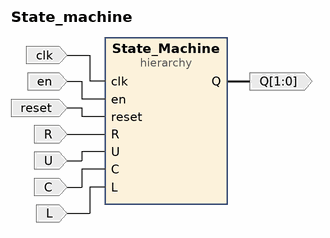
[diagram p0: block diagram of the top level]
# Vivado block design State_machine, xc7a35tcpg236-1, Vivado 2018.3
create_bd_design State_machine

create_bd_port -dir I R
create_bd_port -dir I U
create_bd_port -dir I C
create_bd_port -dir I L
create_bd_port -dir O -from 1 -to 0 Q
create_bd_port -dir I -type clk clk
create_bd_port -dir I en
create_bd_port -dir I -type rst reset

create_bd_cell -type hier State_Machine

# ---- hierarchy /State_Machine ----
current_bd_instance /State_Machine
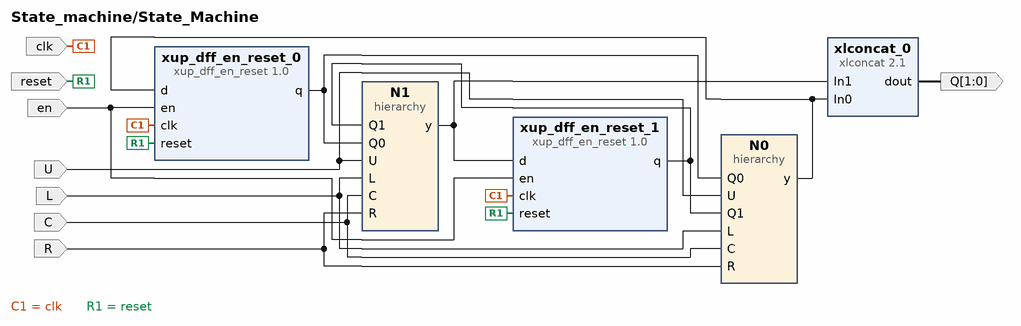
[diagram p1: block diagram inside /State_Machine]
create_bd_pin -dir I -type clk clk
create_bd_pin -dir I en
create_bd_pin -dir I -type rst reset
create_bd_pin -dir O -from 1 -to 0 Q
create_bd_pin -dir I U
create_bd_pin -dir I L
create_bd_pin -dir I C
create_bd_pin -dir I R

create_bd_cell -type ip -vlnv xilinx.com:XUP:xup_dff_en_reset:1.0 xup_dff_en_reset_0
set_property -dict {CONFIG.DELAY 0} [get_bd_cells xup_dff_en_reset_0]
create_bd_cell -type ip -vlnv xilinx.com:ip:xlconcat:2.1 xlconcat_0
create_bd_cell -type ip -vlnv xilinx.com:XUP:xup_dff_en_reset:1.0 xup_dff_en_reset_1
set_property -dict {CONFIG.DELAY 0} [get_bd_cells xup_dff_en_reset_1]
create_bd_cell -type hier N0
create_bd_cell -type hier N1

# ---- hierarchy /State_Machine/N0 ----
current_bd_instance /State_Machine/N0
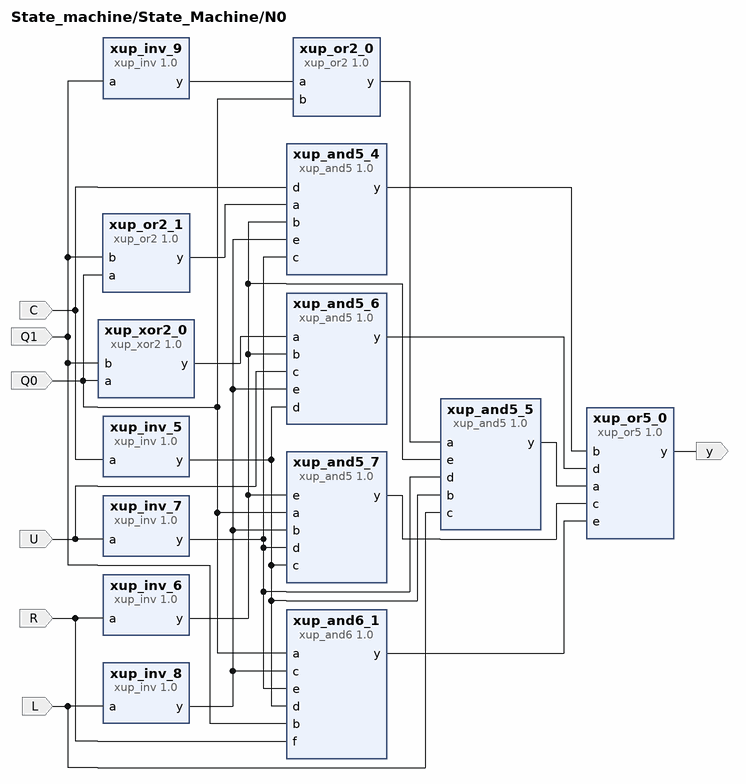
[diagram p2: block diagram inside /State_Machine/N0]
create_bd_pin -dir I Q0
create_bd_pin -dir I Q1
create_bd_pin -dir I U
create_bd_pin -dir I L
create_bd_pin -dir O y
create_bd_pin -dir I C
create_bd_pin -dir I R

create_bd_cell -type ip -vlnv xilinx.com:XUP:xup_or2:1.0 xup_or2_1
set_property -dict {CONFIG.DELAY 0} [get_bd_cells xup_or2_1]
create_bd_cell -type ip -vlnv xilinx.com:XUP:xup_inv:1.0 xup_inv_7
set_property -dict {CONFIG.DELAY 0} [get_bd_cells xup_inv_7]
create_bd_cell -type ip -vlnv xilinx.com:XUP:xup_inv:1.0 xup_inv_8
set_property -dict {CONFIG.DELAY 0} [get_bd_cells xup_inv_8]
create_bd_cell -type ip -vlnv xilinx.com:XUP:xup_or5:1.0 xup_or5_0
set_property -dict {CONFIG.DELAY 0} [get_bd_cells xup_or5_0]
create_bd_cell -type ip -vlnv xilinx.com:XUP:xup_xor2:1.0 xup_xor2_0
set_property -dict {CONFIG.DELAY 0} [get_bd_cells xup_xor2_0]
create_bd_cell -type ip -vlnv xilinx.com:XUP:xup_and5:1.0 xup_and5_4
set_property -dict {CONFIG.DELAY 0} [get_bd_cells xup_and5_4]
create_bd_cell -type ip -vlnv xilinx.com:XUP:xup_and5:1.0 xup_and5_5
set_property -dict {CONFIG.DELAY 0} [get_bd_cells xup_and5_5]
create_bd_cell -type ip -vlnv xilinx.com:XUP:xup_and6:1.0 xup_and6_1
set_property -dict {CONFIG.DELAY 0} [get_bd_cells xup_and6_1]
create_bd_cell -type ip -vlnv xilinx.com:XUP:xup_and5:1.0 xup_and5_6
set_property -dict {CONFIG.DELAY 0} [get_bd_cells xup_and5_6]
create_bd_cell -type ip -vlnv xilinx.com:XUP:xup_and5:1.0 xup_and5_7
set_property -dict {CONFIG.DELAY 0} [get_bd_cells xup_and5_7]
create_bd_cell -type ip -vlnv xilinx.com:XUP:xup_inv:1.0 xup_inv_5
set_property -dict {CONFIG.DELAY 0} [get_bd_cells xup_inv_5]
create_bd_cell -type ip -vlnv xilinx.com:XUP:xup_inv:1.0 xup_inv_6
set_property -dict {CONFIG.DELAY 0} [get_bd_cells xup_inv_6]
create_bd_cell -type ip -vlnv xilinx.com:XUP:xup_or2:1.0 xup_or2_0
set_property -dict {CONFIG.DELAY 0} [get_bd_cells xup_or2_0]
create_bd_cell -type ip -vlnv xilinx.com:XUP:xup_inv:1.0 xup_inv_9
set_property -dict {CONFIG.DELAY 0} [get_bd_cells xup_inv_9]

# ---- hierarchy /State_Machine/N1 ----
current_bd_instance /State_Machine/N1
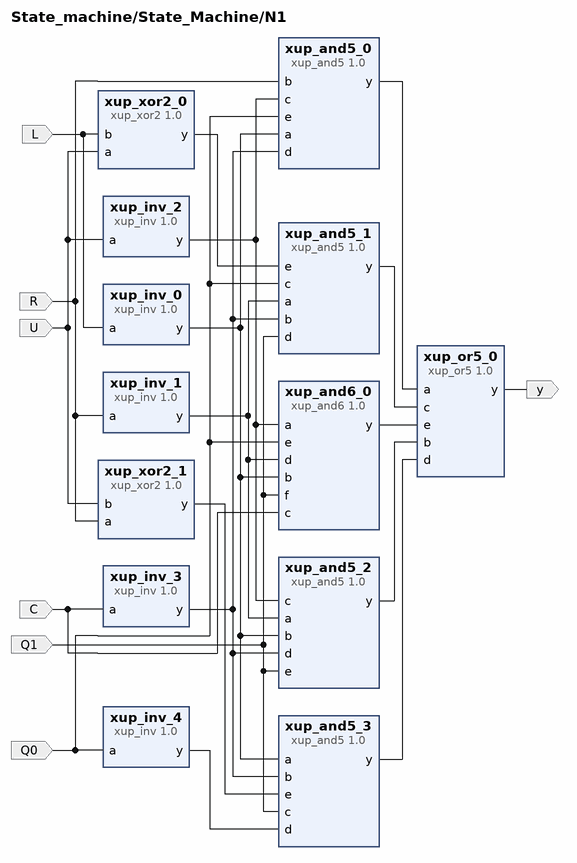
[diagram p3: block diagram inside /State_Machine/N1]
create_bd_pin -dir I Q1
create_bd_pin -dir O y
create_bd_pin -dir I U
create_bd_pin -dir I L
create_bd_pin -dir I C
create_bd_pin -dir I Q0
create_bd_pin -dir I R

create_bd_cell -type ip -vlnv xilinx.com:XUP:xup_and5:1.0 xup_and5_2
set_property -dict {CONFIG.DELAY 0} [get_bd_cells xup_and5_2]
create_bd_cell -type ip -vlnv xilinx.com:XUP:xup_and5:1.0 xup_and5_3
set_property -dict {CONFIG.DELAY 0} [get_bd_cells xup_and5_3]
create_bd_cell -type ip -vlnv xilinx.com:XUP:xup_or5:1.0 xup_or5_0
set_property -dict {CONFIG.DELAY 0} [get_bd_cells xup_or5_0]
create_bd_cell -type ip -vlnv xilinx.com:XUP:xup_xor2:1.0 xup_xor2_0
set_property -dict {CONFIG.DELAY 0} [get_bd_cells xup_xor2_0]
create_bd_cell -type ip -vlnv xilinx.com:XUP:xup_and6:1.0 xup_and6_0
set_property -dict {CONFIG.DELAY 0} [get_bd_cells xup_and6_0]
create_bd_cell -type ip -vlnv xilinx.com:XUP:xup_inv:1.0 xup_inv_0
set_property -dict {CONFIG.DELAY 0} [get_bd_cells xup_inv_0]
create_bd_cell -type ip -vlnv xilinx.com:XUP:xup_inv:1.0 xup_inv_1
set_property -dict {CONFIG.DELAY 0} [get_bd_cells xup_inv_1]
create_bd_cell -type ip -vlnv xilinx.com:XUP:xup_inv:1.0 xup_inv_2
set_property -dict {CONFIG.DELAY 0} [get_bd_cells xup_inv_2]
create_bd_cell -type ip -vlnv xilinx.com:XUP:xup_inv:1.0 xup_inv_3
set_property -dict {CONFIG.DELAY 0} [get_bd_cells xup_inv_3]
create_bd_cell -type ip -vlnv xilinx.com:XUP:xup_inv:1.0 xup_inv_4
set_property -dict {CONFIG.DELAY 0} [get_bd_cells xup_inv_4]
create_bd_cell -type ip -vlnv xilinx.com:XUP:xup_and5:1.0 xup_and5_0
set_property -dict {CONFIG.DELAY 0} [get_bd_cells xup_and5_0]
create_bd_cell -type ip -vlnv xilinx.com:XUP:xup_and5:1.0 xup_and5_1
set_property -dict {CONFIG.DELAY 0} [get_bd_cells xup_and5_1]
create_bd_cell -type ip -vlnv xilinx.com:XUP:xup_xor2:1.0 xup_xor2_1
set_property -dict {CONFIG.DELAY 0} [get_bd_cells xup_xor2_1]

# ---- connections ----

current_bd_instance /State_Machine
connect_bd_net -net xup_or5_0_y1 [get_bd_pins N0/y] [get_bd_pins xup_dff_en_reset_0/d] [get_bd_pins xlconcat_0/In0]
connect_bd_net [get_bd_pins xup_dff_en_reset_0/q] [get_bd_pins N1/Q0] [get_bd_pins N0/Q0]
connect_bd_net -net xup_or5_0_y [get_bd_pins N1/y] [get_bd_pins xup_dff_en_reset_1/d] [get_bd_pins xlconcat_0/In1]
connect_bd_net [get_bd_pins xup_dff_en_reset_1/q] [get_bd_pins N1/Q1] [get_bd_pins N0/Q1]
connect_bd_net -net clk_0_1 [get_bd_pins clk] [get_bd_pins xup_dff_en_reset_1/clk] [get_bd_pins xup_dff_en_reset_0/clk]
connect_bd_net -net en_0_1 [get_bd_pins en] [get_bd_pins xup_dff_en_reset_1/en] [get_bd_pins xup_dff_en_reset_0/en]
connect_bd_net -net reset_0_1 [get_bd_pins reset] [get_bd_pins xup_dff_en_reset_1/reset] [get_bd_pins xup_dff_en_reset_0/reset]
connect_bd_net [get_bd_pins xlconcat_0/dout] [get_bd_pins Q]
connect_bd_net [get_bd_pins U] [get_bd_pins N1/U] [get_bd_pins N0/U]
connect_bd_net [get_bd_pins L] [get_bd_pins N1/L] [get_bd_pins N0/L]
connect_bd_net [get_bd_pins C] [get_bd_pins N1/C] [get_bd_pins N0/C]
connect_bd_net [get_bd_pins R] [get_bd_pins N1/R] [get_bd_pins N0/R]

current_bd_instance /State_Machine/N0
connect_bd_net [get_bd_pins xup_or2_1/y] [get_bd_pins xup_and5_4/a]
connect_bd_net [get_bd_pins xup_inv_7/y] [get_bd_pins xup_and5_5/d] [get_bd_pins xup_and5_4/c] [get_bd_pins xup_and5_7/d] [get_bd_pins xup_and6_1/e]
connect_bd_net [get_bd_pins xup_inv_8/y] [get_bd_pins xup_and5_4/e] [get_bd_pins xup_and5_7/b] [get_bd_pins xup_and6_1/c] [get_bd_pins xup_and5_6/e]
connect_bd_net [get_bd_pins xup_and5_5/y] [get_bd_pins xup_or5_0/a]
connect_bd_net [get_bd_pins xup_and5_4/y] [get_bd_pins xup_or5_0/b]
connect_bd_net [get_bd_pins xup_and5_7/y] [get_bd_pins xup_or5_0/c]
connect_bd_net [get_bd_pins xup_and5_6/y] [get_bd_pins xup_or5_0/d]
connect_bd_net [get_bd_pins xup_and6_1/y] [get_bd_pins xup_or5_0/e]
connect_bd_net [get_bd_pins xup_xor2_0/y] [get_bd_pins xup_and5_6/a]
connect_bd_net [get_bd_pins xup_inv_6/y] [get_bd_pins xup_and5_5/e] [get_bd_pins xup_and5_4/b] [get_bd_pins xup_and5_7/e] [get_bd_pins xup_and5_6/b]
connect_bd_net [get_bd_pins xup_or2_0/y] [get_bd_pins xup_and5_5/a]
connect_bd_net [get_bd_pins xup_inv_5/y] [get_bd_pins xup_and5_5/b] [get_bd_pins xup_and5_7/c] [get_bd_pins xup_and6_1/d] [get_bd_pins xup_and5_6/d]
connect_bd_net [get_bd_pins xup_inv_9/y] [get_bd_pins xup_or2_0/a]
connect_bd_net -net xup_dff_en_reset_0_q [get_bd_pins Q0] \
  [get_bd_pins xup_xor2_0/a] [get_bd_pins xup_or2_0/b] [get_bd_pins xup_and5_7/a] [get_bd_pins xup_and6_1/a] \
  [get_bd_pins xup_or2_1/a]
connect_bd_net -net xup_dff_en_reset_1_q [get_bd_pins Q1] \
  [get_bd_pins xup_inv_9/a] [get_bd_pins xup_xor2_0/b] [get_bd_pins xup_and6_1/b] [get_bd_pins xup_or2_1/b]
connect_bd_net [get_bd_pins U] [get_bd_pins xup_and5_6/c] [get_bd_pins xup_inv_7/a]
connect_bd_net [get_bd_pins L] [get_bd_pins xup_and5_5/c] [get_bd_pins xup_inv_8/a]
connect_bd_net [get_bd_pins xup_or5_0/y] [get_bd_pins y]
connect_bd_net [get_bd_pins C] [get_bd_pins xup_inv_5/a] [get_bd_pins xup_and5_4/d]
connect_bd_net [get_bd_pins R] [get_bd_pins xup_inv_6/a] [get_bd_pins xup_and6_1/f]

current_bd_instance /State_Machine/N1
connect_bd_net [get_bd_pins xup_inv_1/y] [get_bd_pins xup_and5_2/a] [get_bd_pins xup_and5_1/a] [get_bd_pins xup_and6_0/d]
connect_bd_net [get_bd_pins xup_inv_0/y] [get_bd_pins xup_and5_0/a] [get_bd_pins xup_and5_2/b] [get_bd_pins xup_and5_3/a] [get_bd_pins xup_and6_0/b]
connect_bd_net [get_bd_pins xup_inv_2/y] [get_bd_pins xup_and5_0/c] [get_bd_pins xup_and5_2/c] [get_bd_pins xup_and6_0/a]
connect_bd_net [get_bd_pins xup_inv_3/y] [get_bd_pins xup_and5_0/d] [get_bd_pins xup_and5_2/d] [get_bd_pins xup_and5_1/b] [get_bd_pins xup_and5_3/b]
connect_bd_net [get_bd_pins xup_and5_2/y] [get_bd_pins xup_or5_0/b]
connect_bd_net [get_bd_pins xup_inv_4/y] [get_bd_pins xup_and5_3/d]
connect_bd_net [get_bd_pins xup_xor2_1/y] [get_bd_pins xup_and5_3/e]
connect_bd_net [get_bd_pins xup_and5_3/y] [get_bd_pins xup_or5_0/d]
connect_bd_net [get_bd_pins xup_and5_0/y] [get_bd_pins xup_or5_0/a]
connect_bd_net [get_bd_pins xup_and5_1/y] [get_bd_pins xup_or5_0/c]
connect_bd_net [get_bd_pins xup_and6_0/y] [get_bd_pins xup_or5_0/e]
connect_bd_net [get_bd_pins xup_xor2_0/y] [get_bd_pins xup_and5_1/e]
connect_bd_net -net xup_dff_en_reset_1_q [get_bd_pins Q1] \
  [get_bd_pins xup_and5_1/d] [get_bd_pins xup_and5_3/c] [get_bd_pins xup_and6_0/f] [get_bd_pins xup_and5_2/e]
connect_bd_net [get_bd_pins xup_or5_0/y] [get_bd_pins y]
connect_bd_net [get_bd_pins U] [get_bd_pins xup_inv_2/a] [get_bd_pins xup_xor2_1/b] [get_bd_pins xup_xor2_0/a]
connect_bd_net [get_bd_pins L] [get_bd_pins xup_inv_0/a] [get_bd_pins xup_xor2_0/b]
connect_bd_net [get_bd_pins C] [get_bd_pins xup_inv_3/a] [get_bd_pins xup_and6_0/c]
connect_bd_net -net xup_dff_en_reset_0_q [get_bd_pins Q0] \
  [get_bd_pins xup_and5_0/e] [get_bd_pins xup_and5_1/c] [get_bd_pins xup_inv_4/a] [get_bd_pins xup_and6_0/e]
connect_bd_net [get_bd_pins R] [get_bd_pins xup_and5_0/b] [get_bd_pins xup_xor2_1/a] [get_bd_pins xup_inv_1/a]

current_bd_instance /
connect_bd_net -net xlconcat_0_dout [get_bd_pins State_Machine/Q] [get_bd_ports Q]
connect_bd_net -net clk_0_1 [get_bd_ports clk] [get_bd_pins State_Machine/clk]
connect_bd_net -net en_0_1 [get_bd_ports en] [get_bd_pins State_Machine/en]
connect_bd_net -net reset_0_1 [get_bd_ports reset] [get_bd_pins State_Machine/reset]
connect_bd_net [get_bd_ports R] [get_bd_pins State_Machine/R]
connect_bd_net [get_bd_ports U] [get_bd_pins State_Machine/U]
connect_bd_net [get_bd_ports C] [get_bd_pins State_Machine/C]
connect_bd_net [get_bd_ports L] [get_bd_pins State_Machine/L]

validate_bd_design
save_bd_design
